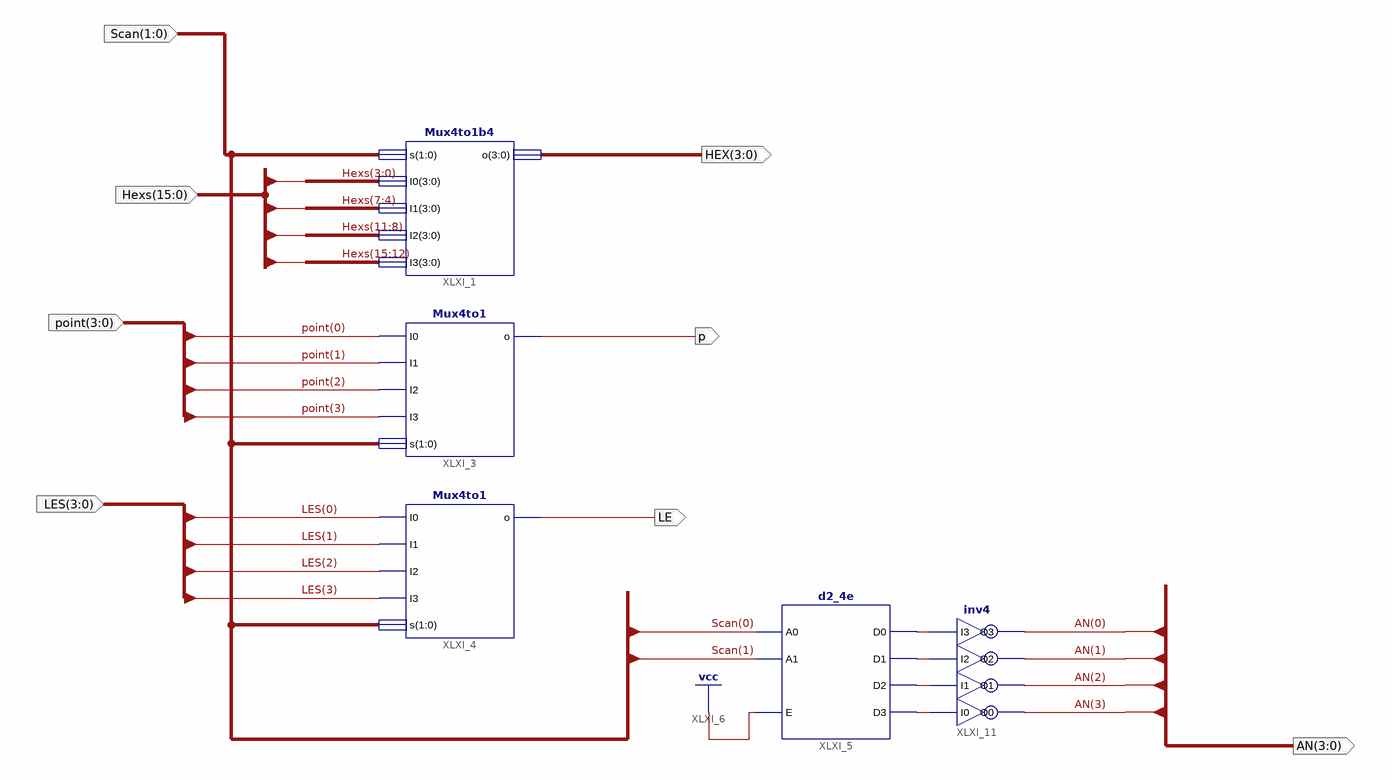
[diagram p0: schematic sheet 1]
// Xilinx ISE schematic DispNum_Num.sch (kintex7) as structural Verilog: 5 symbols, 8 ports
module DispNum_Num (
  input  [15:0] Hexs,
  input  [3:0] point,
  input  [1:0] Scan,
  input  [3:0] LES,
  output [3:0] HEX,
  output p,
  output LE,
  output [3:0] AN
);

  wire XLXN_38, XLXN_39, XLXN_40, XLXN_41;

  Mux4to1b4 XLXI_1 (.s(Scan), .I0(Hexs[3:0]), .I1(Hexs[7:4]), .I2(Hexs[11:8]), .I3(Hexs[15:12]), .o(HEX));
  Mux4to1 XLXI_3 (.I0(point[0]), .I1(point[1]), .I2(point[2]), .I3(point[3]), .s(Scan), .o(p));
  Mux4to1 XLXI_4 (.I0(LES[0]), .I1(LES[1]), .I2(LES[2]), .I3(LES[3]), .s(Scan), .o(LE));
  d2_4e XLXI_5 (.A0(Scan[0]), .A1(Scan[1]), .E(1'b1), .D0(XLXN_41), .D1(XLXN_40), .D2(XLXN_39), .D3(XLXN_38));
  inv4 XLXI_11 (.I0(XLXN_38), .I1(XLXN_39), .I2(XLXN_40), .I3(XLXN_41), .O0(AN[3]), .O1(AN[2]), .O2(AN[1]), .O3(AN[0]));
endmodule
